# EAGLE design RetroAdapter2CommonGround (EAGLE 8.1.0)
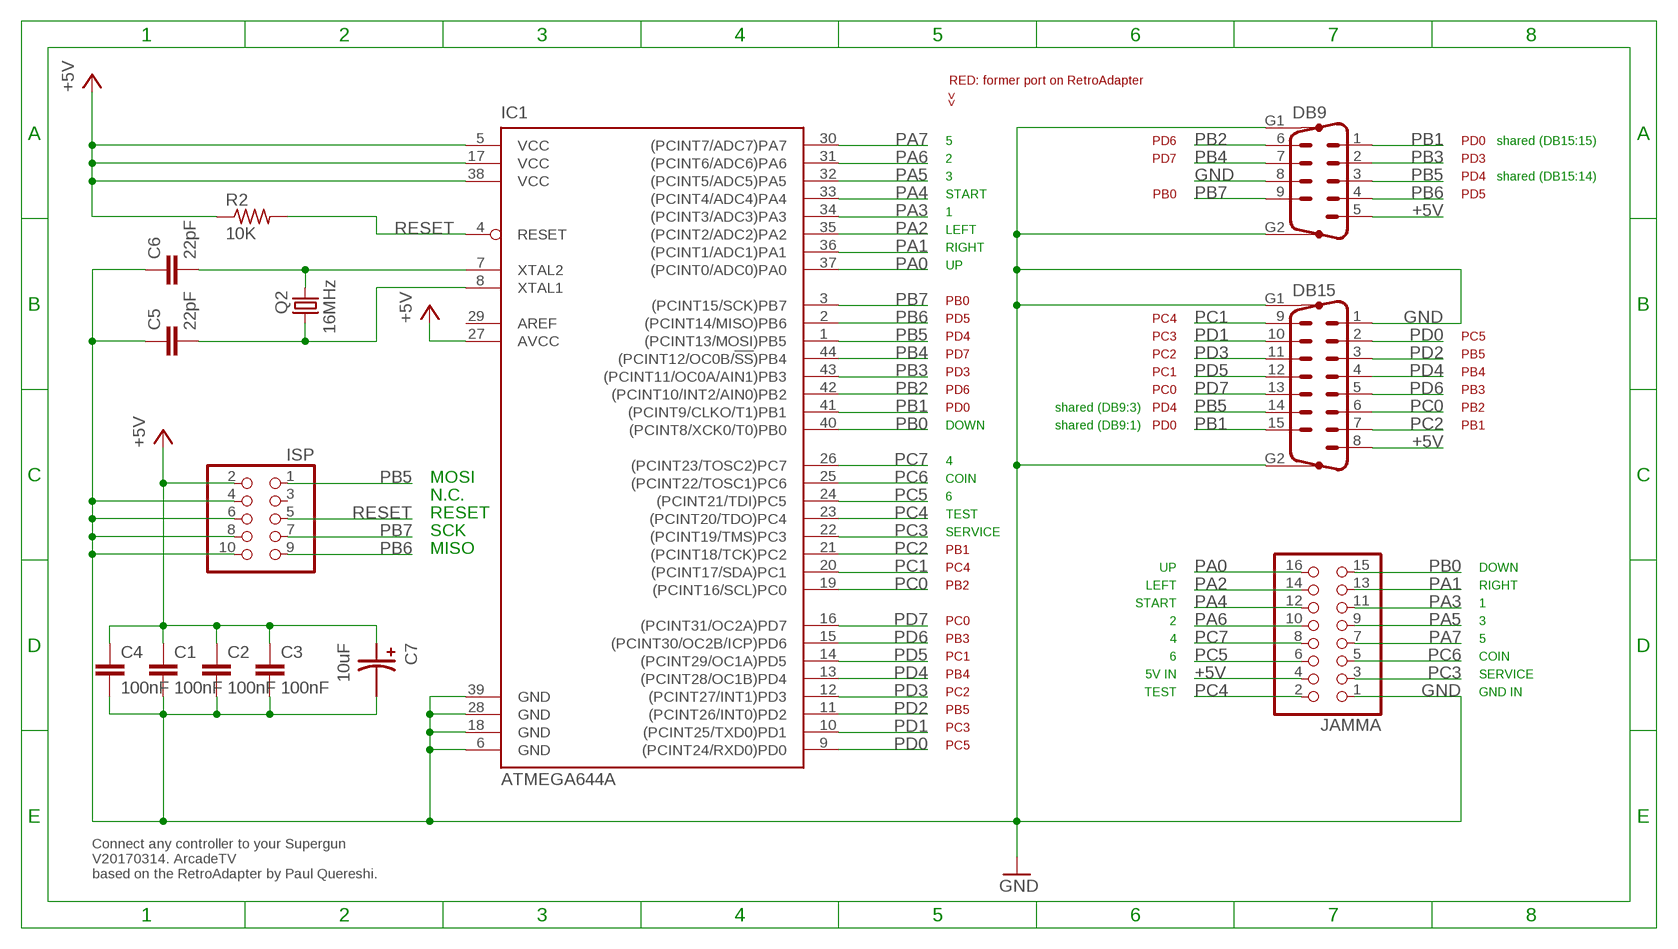
[diagram p0: schematic, sheet 1]

## Parts
C1  100nF  C0805  [Z0805]
C2  100nF  C0805  [Z0805]
C3  100nF  C0805  [Z0805]
C4  100nF  C0805  [Z0805]
C5  22pF  C0805  [Z0805]
C6  22pF  C0805  [Z0805]
C7  10uF  EEEFPJ101UAR_PANASONIC_VFP-SERIES  [EEEFPJ101UAR_PANASONIC_VFP-SERIES]
DB9  M09HP  [M09HP]
DB15  M15HP  [M15HP]
IC1  ATMEGA644A  [TQFP44]
ISP  PINHD-2X5  [2X05]
JAMMA  PINHD-2X8  [2X08]
Q2  16MHz  CRYSTALHC49S  [HC49/S]
R2  10K  R-US_R0603  [R0603]

## Nets
+5V: C1.1 C2.1 C3.1 C4.1 C7.PLUS(+) DB9.5 DB15.8 IC1.5(VCC) IC1.17(VCC) IC1.27(AVCC) IC1.38(VCC) ISP.2 JAMMA.4 R2.1
GND: C1.2 C2.2 C3.2 C4.2 C5.1 C6.1 C7.MINUS(-) DB9.8 DB9.G1 DB9.G2 DB15.1 DB15.G1 DB15.G2 IC1.6(GND) IC1.18(GND) IC1.28(GND) IC1.39(GND) ISP.4 ISP.6 ISP.8 ISP.10 JAMMA.1
N$18: C5.2 IC1.8(XTAL1) Q2.1
N$41: C6.2 IC1.7(XTAL2) Q2.2
PA0: IC1.37((PCINT0/ADC0)PA0) JAMMA.16
PA1: IC1.36((PCINT1/ADC1)PA1) JAMMA.13
PA2: IC1.35((PCINT2/ADC2)PA2) JAMMA.14
PA3: IC1.34((PCINT3/ADC3)PA3) JAMMA.11
PA4: IC1.33((PCINT4/ADC4)PA4) JAMMA.12
PA5: IC1.32((PCINT5/ADC5)PA5) JAMMA.9
PA6: IC1.31((PCINT6/ADC6)PA6) JAMMA.10
PA7: IC1.30((PCINT7/ADC7)PA7) JAMMA.7
PB0: IC1.40((PCINT8/XCK0/T0)PB0) JAMMA.15
PB1: DB9.1 DB15.15 IC1.41((PCINT9/CLKO/T1)PB1)
PB2: DB9.6 IC1.42((PCINT10/INT2/AIN0)PB2)
PB3: DB9.2 IC1.43((PCINT11/OC0A/AIN1)PB3)
PB4: DB9.7 IC1.44((PCINT12/OC0B/!SS!)PB4)
PB5: DB9.3 DB15.14 IC1.1((PCINT13/MOSI)PB5) ISP.1
PB6: DB9.4 IC1.2((PCINT14/MISO)PB6) ISP.9
PB7: DB9.9 IC1.3((PCINT15/SCK)PB7) ISP.7
PC0: DB15.6 IC1.19((PCINT16/SCL)PC0)
PC1: DB15.9 IC1.20((PCINT17/SDA)PC1)
PC2: DB15.7 IC1.21((PCINT18/TCK)PC2)
PC3: IC1.22((PCINT19/TMS)PC3) JAMMA.3
PC4: IC1.23((PCINT20/TDO)PC4) JAMMA.2
PC5: IC1.24((PCINT21/TDI)PC5) JAMMA.6
PC6: IC1.25((PCINT22/TOSC1)PC6) JAMMA.5
PC7: IC1.26((PCINT23/TOSC2)PC7) JAMMA.8
PD0: DB15.2 IC1.9((PCINT24/RXD0)PD0)
PD1: DB15.10 IC1.10((PCINT25/TXD0)PD1)
PD2: DB15.3 IC1.11((PCINT26/INT0)PD2)
PD3: DB15.11 IC1.12((PCINT27/INT1)PD3)
PD4: DB15.4 IC1.13((PCINT28/OC1B)PD4)
PD5: DB15.12 IC1.14((PCINT29/OC1A)PD5)
PD6: DB15.5 IC1.15((PCINT30/OC2B/ICP)PD6)
PD7: DB15.13 IC1.16((PCINT31/OC2A)PD7)
RESET: IC1.4(RESET) ISP.5 R2.2
Unconnected: IC1.29(AREF) ISP.3

## Notes on the sheet
- RED: former port on RetroAdapter
- <<
- 5 | PD6 | PD0 | shared (DB15:15)
- 2 | PD7 | PD3
- 3 | PD4 | shared (DB15:14)
- START | PB0 | PD5
- 1
- LEFT
- RIGHT
- UP
- PB0
- PD5 | PC4
- PD4 | PC3 | PC5
- PD7 | PC2 | PB5
- PD3 | PC1 | PB4
- PD6 | PC0 | PB3
- PD0 | shared (DB9:3) | PD4 | PB2
- DOWN | shared (DB9:1) | PD0 | PB1
- 4
- MOSI | COIN
- N.C. | 6
- RESET | TEST
- SCK | SERVICE
- MISO | PB1
- PC4 | UP | DOWN
- PB2 | LEFT | RIGHT
- START | 1
- PC0 | 2 | 3
- PB3 | 4 | 5
- PC1 | 6 | COIN
- PB4 | 5V IN | SERVICE
- PC2 | TEST | GND IN
- PB5
- PC3
- PC5
- Connect any controller to your Supergun
  V20170314. ArcadeTV 
  based on the RetroAdapter by Paul Quereshi.

## Library data of the parts
C1-C6 = arcadetv:C0805
C7 = arcadetv:EEEFPJ101UAR_PANASONIC_VFP-SERIES
DB9 = con-subd:M09HP: SUB-D; OC_FARNELL: unknown; OC_NEWARK: unknown
DB15 = con-subd:M15HP: SUB-D; OC_FARNELL: unknown; OC_NEWARK: unknown
IC1 = arcadetv:ATMEGA644: 8-bit Microcontroller with 64K Bytes In-System Programmable Flash Source: http://www.atmel.com/dyn/resources/prod_documents/doc2593.pdf; MPN: ATMEGA644PV-10AU; OC_FARNELL: 1455123; OC_NEWARK: 58M3748
ISP = pinhead:PINHD-2X5: PIN HEADER
JAMMA = pinhead:PINHD-2X8: PIN HEADER
Q2 = crystal:CRYSTAL: CRYSTAL
R2 = rcl:R-US_: RESISTOR, American symbol

## Board
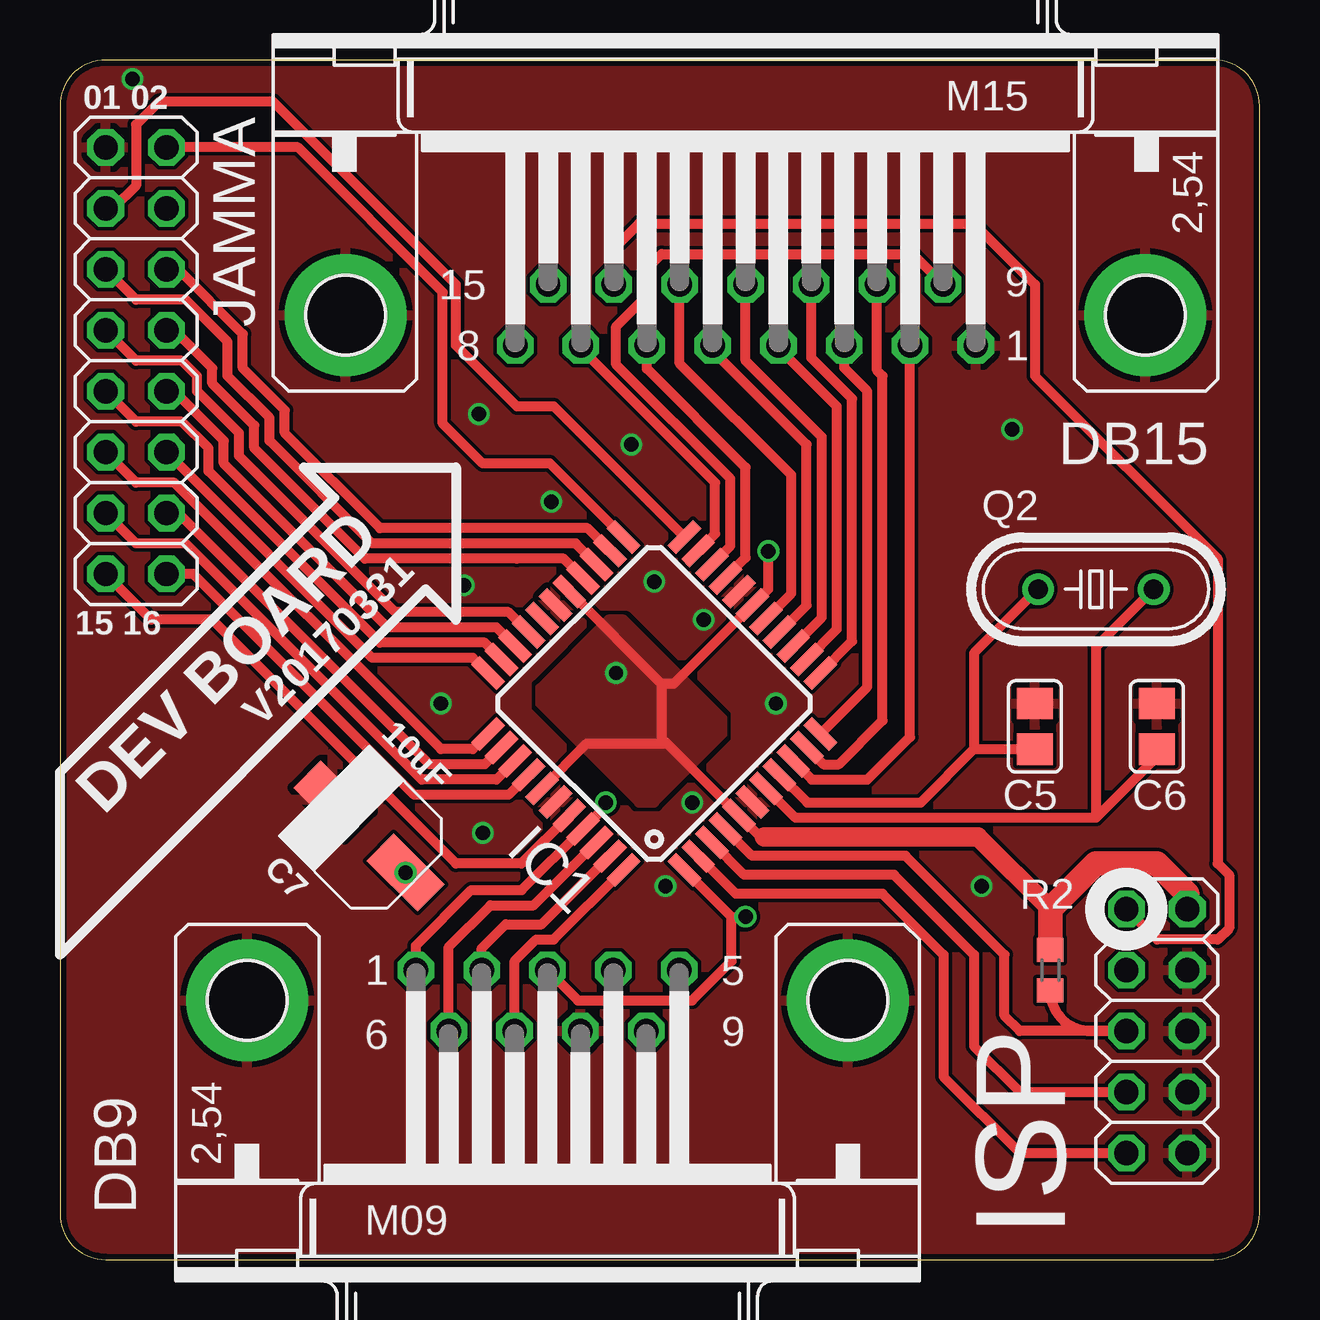
[diagram p1: board, top side]
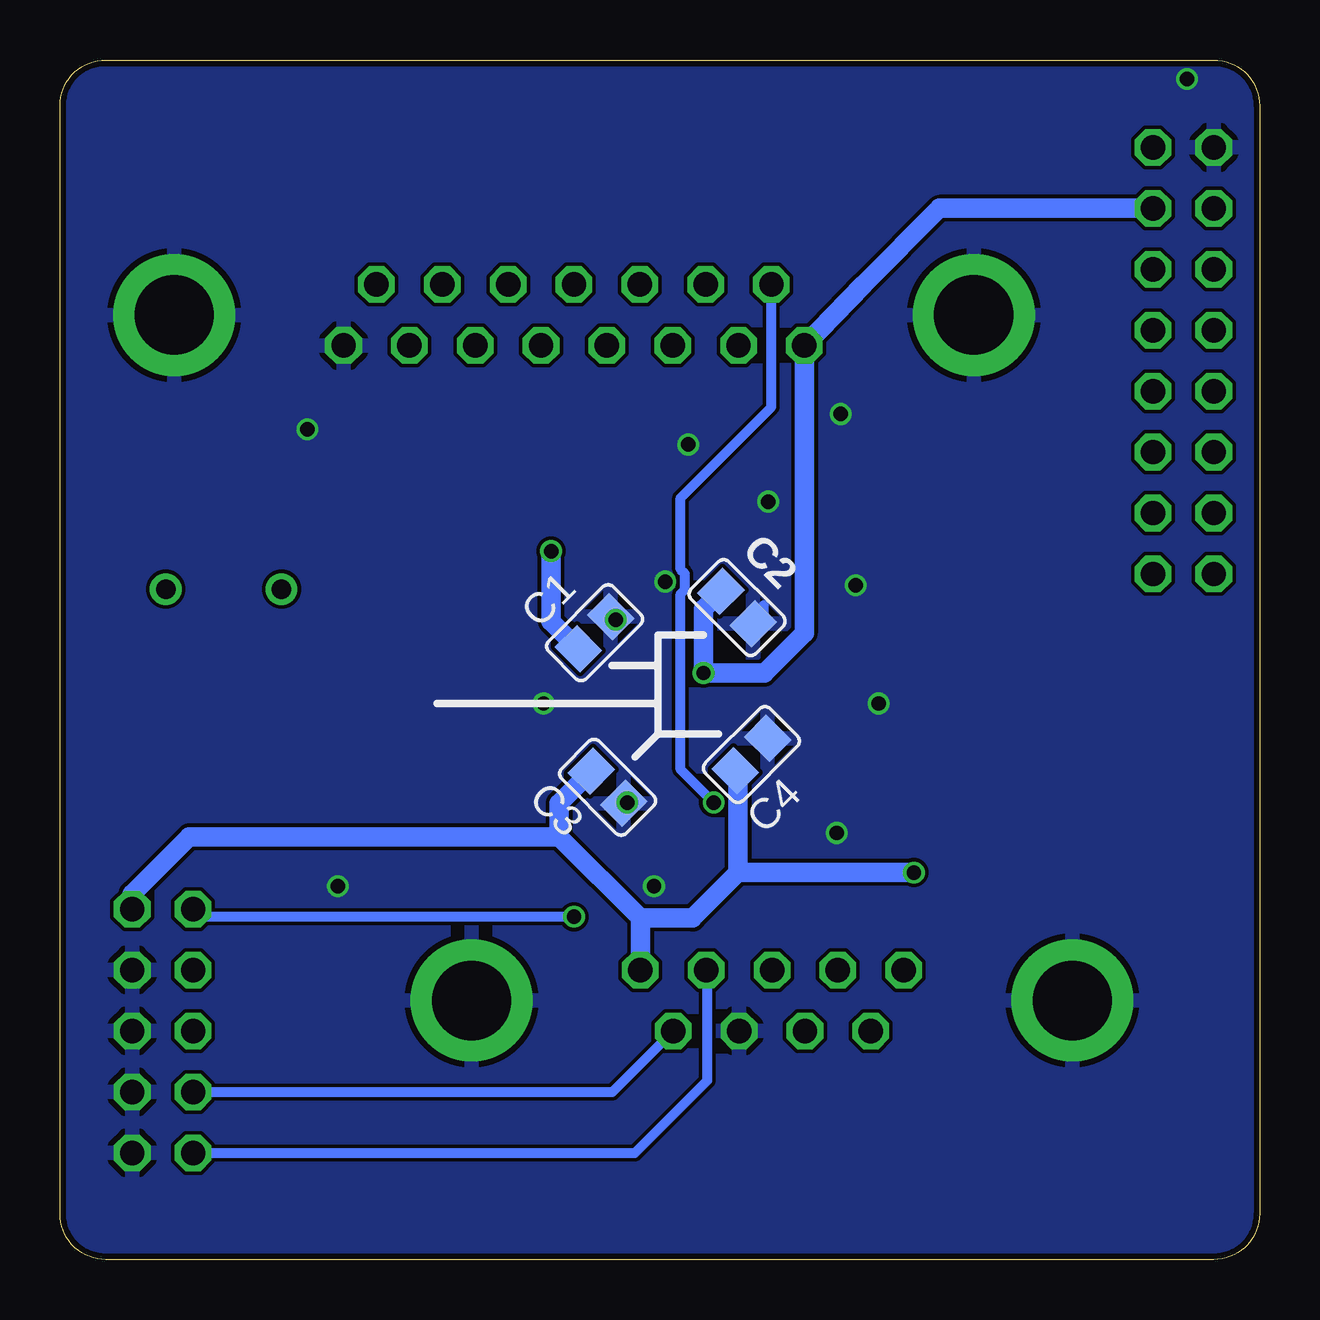
[diagram p2: board, bottom side, seen from below]

Size 50 x 50 mm. Coordinates in mm from the lower left corner, seen from the top.
Outline: 0,48.09 0,1.91 arc90 1.91,0 48.09,0 arc90 50,1.91 50,48.09 arc90 48.09,50 1.91,50 arc90 0,48.09
Copper layers (1*16): Top 0.035mm / dielectric 1.5mm / Bottom 0.035mm
Design rules "ITEADstudioDRC": minimum track width 6mil, minimum drill 12mil, track to track 6mil, track to pad 6mil, pad to pad 6mil, via to via 6mil, smd to smd 0mil, copper to edge 10mil, drill to drill 10mil, minimum pad ring 10mil, minimum via ring 6mil, stop-mask expansion 2mil, vias tented up to drill 100mil, thermal gap 10mil

### Footprints (pad centres in the part's own frame; a part is rotated, then mirrored left to right if it is on the bottom)
Z0805 = smd 1.3 x 1.5: 1 -0.95,0; 2 0.95,0
EEEFPJ101UAR_PANASONIC_VFP-SERIES = smd 1.6 x 3: MINUS 0,2.15; PLUS 0,-2.15
M09HP = drill 1.016 octagon: 1 -5.486,1.27; 2 -2.743,1.27; 3 0,1.27; 4 2.743,1.27; 5 5.486,1.27; 6 -4.115,-1.27; 7 -1.372,-1.27; 8 1.372,-1.27; 9 4.115,-1.27 | drill 3.302 pad 5.08: G1 -12.522,0; G2 12.522,0
M15HP = drill 1.016 octagon: 1 -9.601,1.27; 2 -6.858,1.27; 3 -4.115,1.27; 4 -1.372,1.27; 5 1.372,1.27; 6 4.115,1.27; 7 6.858,1.27; 8 9.601,1.27; 9 -8.23,-1.27; 10 -5.486,-1.27; 11 -2.743,-1.27; 12 0,-1.27; 13 2.743,-1.27; 14 5.486,-1.27; 15 8.23,-1.27 | drill 3.302 pad 5.08: G1 -16.662,0; G2 16.662,0
TQFP44 = smd 1.5 x 0.5: 1 -5.8,4; 2 -5.8,3.2; 3 -5.8,2.4; 4 -5.8,1.6; 5 -5.8,0.8; 6 -5.8,0; 7 -5.8,-0.8; 8 -5.8,-1.6; 9 -5.8,-2.4; 10 -5.8,-3.2; 11 -5.8,-4; 23 5.8,-4; 24 5.8,-3.2; 25 5.8,-2.4; 26 5.8,-1.6; 27 5.8,-0.8; 28 5.8,0; 29 5.8,0.8; 30 5.8,1.6; 31 5.8,2.4; 32 5.8,3.2; 33 5.8,4 | smd 0.5 x 1.5: 12 -4,-5.8; 13 -3.2,-5.8; 14 -2.4,-5.8; 15 -1.6,-5.8; 16 -0.8,-5.8; 17 0,-5.8; 18 0.8,-5.8; 19 1.6,-5.8; 20 2.4,-5.8; 21 3.2,-5.8; 22 4,-5.8; 34 4,5.8; 35 3.2,5.8; 36 2.4,5.8; 37 1.6,5.8; 38 0.8,5.8; 39 0,5.8; 40 -0.8,5.8; 41 -1.6,5.8; 42 -2.4,5.8; 43 -3.2,5.8; 44 -4,5.8
2X05 = drill 1.016 octagon: 1 -5.08,-1.27; 2 -5.08,1.27; 3 -2.54,-1.27; 4 -2.54,1.27; 5 0,-1.27; 6 0,1.27; 7 2.54,-1.27; 8 2.54,1.27; 9 5.08,-1.27; 10 5.08,1.27
2X08 = drill 1.016 octagon: 1 -8.89,-1.27; 2 -8.89,1.27; 3 -6.35,-1.27; 4 -6.35,1.27; 5 -3.81,-1.27; 6 -3.81,1.27; 7 -1.27,-1.27; 8 -1.27,1.27; 9 1.27,-1.27; 10 1.27,1.27; 11 3.81,-1.27; 12 3.81,1.27; 13 6.35,-1.27; 14 6.35,1.27; 15 8.89,-1.27; 16 8.89,1.27
HC49/S = drill 0.813: 1 -2.413,0; 2 2.413,0
R0603 = smd 1 x 1.1: 1 -0.85,0; 2 0.85,0

### Placement (x,y rotation side)
C1  27.72,26.13 45 bottom
C2  21.78,27.17 315 bottom
C3  27.17,19.68 315 bottom
C4  21.18,21.05 45 bottom
C5  40.64,22.23 270 top
C6  45.72,22.23 270 top
C7  12.89,17.65 45 top
DB9  20.32,10.79 0 top
DB15  28.57,39.37 180 top
IC1  24.77,23.18 135 top
ISP  45.72,9.53 270 top
JAMMA  3.17,37.47 270 top
Q2  43.18,27.94 0 top
R2  41.27,12.06 270 top

### Tracks (layer width: path | path; a pad name or v marks a point on that pad's centre or on a via)
+5V  (via drill 0.6)
  Top 0.406: 25.08,23.99 IC1.27 | 25.08,23.99 25.08,21.73 25.31,21.5 | 25.31,21.5 IC1.5 29.19,17.62 29.37,17.62 | 25.08,23.99 25.58,23.99 IC1.17 29.53,27.94 v29.53,29.53 | IC1.38 21.96,21.5 25.31,21.5
  Top 0.813: 41.27,14.61 38.26,17.62 29.37,17.62
  Top 1.016: R2.1 41.27,14.61 43.18,16.51 45.72,16.51 46.99,15.24 ISP.2
  Bottom 0.813: JAMMA.4 13.34,43.81 16.51,40.64 DB15.8 18.97,26.11 20.64,24.45 v23.18,24.45 23.18,27.11 C2.1 | 25.81,14.24 DB9.5 | 29.19,17.62 25.81,14.24 | 29.19,17.62 44.61,17.62 46.99,15.24 ISP.2 | C7.PLUS 21.74,16.13 | C1.1 29.53,26.6 v29.53,29.53 | C3.1 29.19,19.01 29.19,17.62 | C4.1 21.74,20.27 21.74,16.13 | 21.74,16.13 23.63,14.24 25.81,14.24
  other vias: 14.41,16.13
  pour Top: 22.86,26.67 20,23.81 20,23.18 24.13,19.05 24.77,19.05 27.62,21.91 27.62,22.54 23.81,26.35 23.5,26.67
GND  (via drill 0.6)
  Bottom 0.406: C2.2 20.66,26.94 IC1.28
  other vias: 24.77,28.26 29.84,23.18 39.69,34.61 38.42,15.56 15.88,23.18 17.62,17.78 23.81,33.97 3.02,49.21 26.83,26.67 26.35,19.05 25.24,15.56 16.83,28.1 20.48,31.59 17.46,35.24
  pour Top (rank 2): -1.27,50.8 50.8,50.8 50.8,-1.27 -1.27,-1.27
  pour Bottom: -1.27,50.8 -1.27,-1.27 50.8,-1.27 50.8,50.8
N$18
  Top 0.406: 38.1,21.27 C5.2 | Q2.1 38.1,25.27 38.1,21.27 | IC1.8 31.16,19.05 35.88,19.05 38.1,21.27
N$41
  Top 0.406: 43.18,18.41 45.72,20.96 C6.2 | Q2.2 43.18,25.53 43.18,18.41 | IC1.7 30.66,18.41 43.18,18.41
PA0
  Top 0.406: IC1.37 18.69,19.37 14.76,19.37 5.56,28.57 JAMMA.16
PA1
  Top 0.406: IC1.36 18.2,20 15.08,20 5.24,29.84 3.17,29.84 JAMMA.13
PA2
  Top 0.406: IC1.35 17.7,20.64 15.4,20.64 11.11,24.92 4.92,31.11 JAMMA.14
PA3
  Top 0.406: IC1.34 17.2,21.27 15.88,21.27 4.76,32.38 3.17,32.38 JAMMA.11
PA4
  Top 0.406: IC1.33 17.2,25.08 13.02,25.08 JAMMA.12
PA5
  Top 0.406: IC1.32 17.7,25.72 13.34,25.72 6.19,32.86 6.19,33.81 5.08,34.92 3.17,34.92 JAMMA.9
PA6
  Top 0.406: IC1.31 18.2,26.35 13.65,26.35 6.83,33.18 6.83,34.13 4.76,36.2 JAMMA.10
PA7
  Top 0.406: IC1.30 18.69,26.99 13.97,26.99 7.46,33.5 7.46,34.45 5.71,36.2 5.71,36.83 5.08,37.47 3.17,37.47 JAMMA.7
PB0
  Top 0.406: IC1.40 19.23,16.51 16.51,16.51 6.35,26.67 3.81,26.67 JAMMA.15
PB1  (via drill 0.6)
  Top 0.406: DB9.1 14.83,13.09 17.14,15.4 19.25,15.4 IC1.41 22.7,18.85 22.7,18.89 22.75,18.94 v22.75,19.05
  Bottom 0.406: v22.75,19.05 24.13,20.43 24.13,27.75 23.96,27.92 23.96,28.59 24.13,28.77 24.13,31.75 20.34,35.53 DB15.15
PB2
  Top 0.406: DB9.6 16.2,13.03 17.94,14.76 19.75,14.76 IC1.42
PB3
  Top 0.406: DB9.2 17.58,12.97 18.57,13.97 20.08,13.97 IC1.43
PB4
  Top 0.406: DB9.7 18.95,12.44 19.84,13.34 20.58,13.34 IC1.44
PB5  (via drill 0.6)
  Top 0.406: 28,14.29 IC1.1 | 28,14.29 v28.57,14.29 | DB15.14 23.09,42.14 24.13,43.18 38.1,43.18 40.64,40.64 40.64,36.83 48.26,29.21 48.26,16.51 48.74,16.03 48.74,13.81 48.26,13.34 45.72,13.34 ISP.1 | DB9.3 21.59,10.79 26.35,10.79 28,12.44 28,14.29
  Bottom 0.406: ISP.1 44.13,14.29 v28.57,14.29
PB6
  Top 0.406: ISP.9 40.01,4.45 36.83,7.62 36.83,12.7 34.29,15.24 28.18,15.24 IC1.2
  Bottom 0.406: ISP.9 26.04,4.45 23.02,7.46 23.02,12.02 DB9.4
PB7
  Top 0.406: ISP.7 40.01,6.99 38.1,8.89 38.1,12.7 34.77,16.03 28.52,16.03 IC1.3
  Bottom 0.406: ISP.7 26.98,6.99 DB9.9
PC0
  Top 0.406: IC1.19 28.57,29.25 28.57,33.02 24.46,37.13 DB15.6
PC1
  Top 0.406: IC1.20 27.94,29.75 27.94,32.54 23.18,37.31 23.18,38.89 24.45,40.16 24.45,41.27 25.08,41.91 35.56,41.91 36.8,40.66 DB15.9
PC2
  Top 0.406: IC1.21 27.3,30.24 27.3,32.38 21.72,37.97 DB15.7
PC3
  Top 0.406: IC1.22 20.59,35.56 19.05,35.56 16.51,38.1 16.51,40.64 8.89,48.26 4.13,48.26 3.17,47.31 3.17,44.77 2.22,43.81 JAMMA.3 2.06,43.81
PC4
  Top 0.406: IC1.23 20.42,33.18 17.62,33.18 15.95,34.85 15.95,40.32 9.92,46.35 JAMMA.2
PC5
  Top 0.406: IC1.24 21.99,30.48 13.34,30.48 9.37,34.45 9.37,35.4 7.62,37.15 7.62,38.58 4.92,41.27 JAMMA.6
PC6
  Top 0.406: IC1.25 21.49,29.84 13.02,29.84 8.73,34.13 8.73,35.08 6.99,36.83 6.99,38.26 5.24,40.01 3.17,40.01 JAMMA.5
PC7
  Top 0.406: IC1.26 21,29.21 19.05,29.21 | 19.05,29.21 | 19.05,29.21 12.7,29.21 8.1,33.81 8.1,34.77 6.35,36.51 6.35,37.15 4.76,38.73 JAMMA.8
PD0
  Top 0.406: IC1.9 31.33,20 33.66,20 35.43,21.78 DB15.2
PD1
  Top 0.406: IC1.10 31.83,20.64 32.47,20.64 34.29,22.46 34.29,36.83 34.06,37.06 DB15.10
PD2
  Top 0.406: IC1.11 33.66,23.86 33.66,36.2 32.69,37.16 DB15.3
PD3
  Top 0.406: IC1.12 33.02,25.78 33.02,35.88 31.32,37.58 DB15.11
PD4
  Top 0.406: IC1.13 32.38,26.27 32.38,35.56 29.95,38 DB15.4
PD5
  Top 0.406: IC1.14 31.75,26.77 31.75,34.29 28.57,37.47 DB15.12
PD6
  Top 0.406: IC1.15 31.11,27.27 31.11,33.97 27.2,37.88 DB15.5
PD7
  Top 0.406: IC1.16 30.48,27.76 30.48,32.7 25.83,37.35 DB15.13
RESET
  Top 0.406: R2.2 arc90 42.97,9.53 ISP.5 40.01,9.53 39.37,10.16 39.37,12.7 35.24,16.83 28.85,16.83 IC1.4

### Text on the board
tPlace: 01 02 | DEV BOARD | V20170331 | 15 16